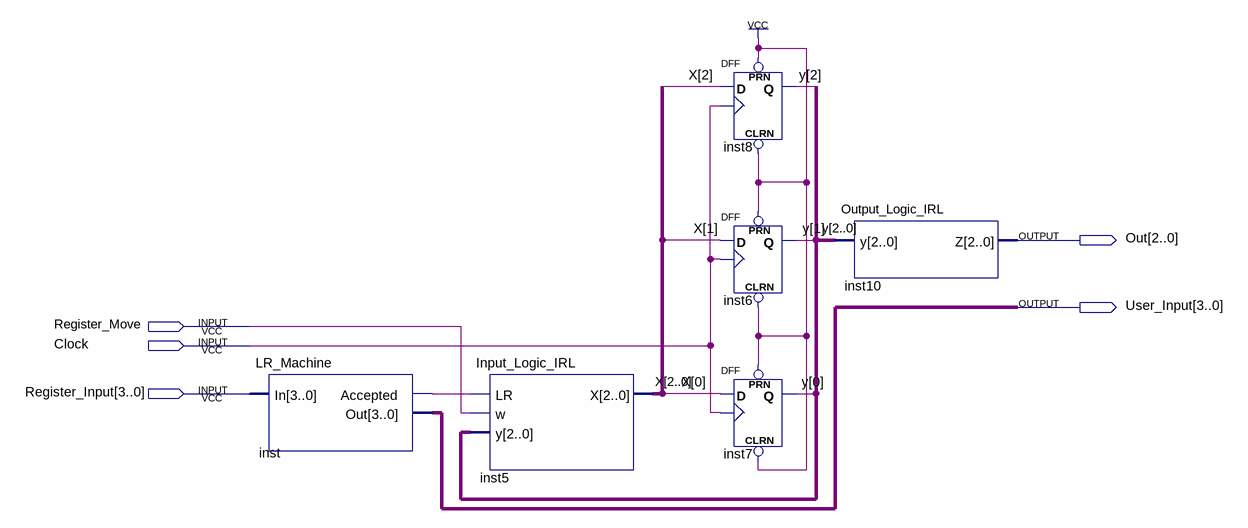
[diagram p0: schematic sheet]
// Quartus schematic IRL_Machine.bdf as structural Verilog: 6 symbols, 5 pins
module IRL_Machine (
  input  Register_Move,
  input  Clock,
  input  [3:0] Register_Input,
  output [2:0] Out,
  output [3:0] User_Input
);

  wire inst_accepted;
  wire [2:0] X, y;

  LR_Machine inst (.In(Register_Input), .Accepted(inst_accepted), .Out(User_Input));
  Input_Logic_IRL inst5 (.LR(inst_accepted), .w(Register_Move), .y(y), .X(X));
  DFF inst8 (.CLRN(1'b1), .CLK(Clock), .D(X[2]), .PRN(1'b1), .Q(y[2]));
  DFF inst6 (.CLRN(1'b1), .CLK(Clock), .D(X[1]), .PRN(1'b1), .Q(y[1]));
  DFF inst7 (.CLRN(1'b1), .CLK(Clock), .D(X[0]), .PRN(1'b1), .Q(y[0]));
  Output_Logic_IRL inst10 (.y(y), .Z(Out));
endmodule
